# EAGLE design brd-gates-low (EAGLE 7.3.0)
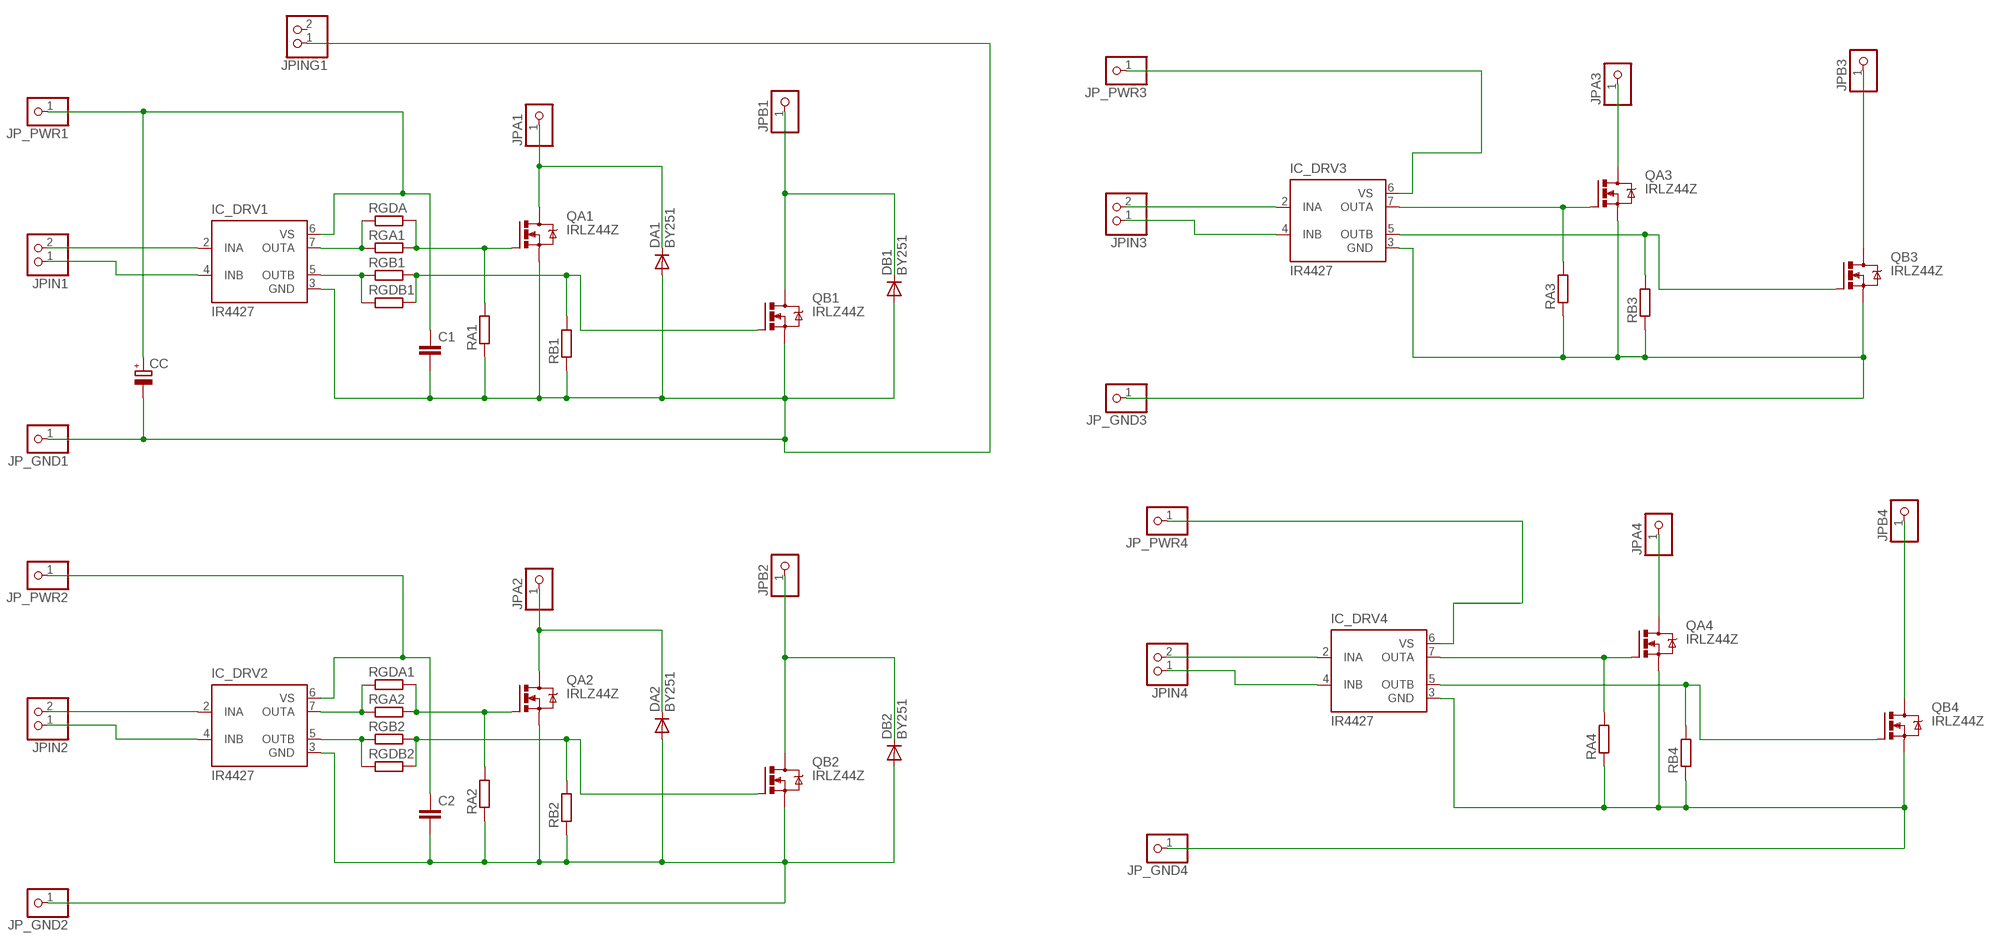
[diagram p0: schematic, sheet 1]

## Parts
C1  C-EU050-055X075  [C050-055X075]
C2  C-EU050-055X075  [C050-055X075]
CC  CPOL-EUE5-13  [E5-13]
DA1  BY251  [DO201-15]
DA2  BY251  [DO201-15]
DB1  BY251  [DO201-15]
DB2  BY251  [DO201-15]
IC_DRV1  IR4427  [DIL08]
IC_DRV2  IR4427  [DIL08]
IC_DRV3  IR4427  [DIL08]
IC_DRV4  IR4427  [DIL08]
JP_GND1  PINHD-1X1  [1X01]
JP_GND2  PINHD-1X1  [1X01]
JP_GND3  PINHD-1X1  [1X01]
JP_GND4  PINHD-1X1  [1X01]
JP_PWR1  PINHD-1X1  [1X01]
JP_PWR2  PINHD-1X1  [1X01]
JP_PWR3  PINHD-1X1  [1X01]
JP_PWR4  PINHD-1X1  [1X01]
JPA1  PINHD-1X1  [1X01]
JPA2  PINHD-1X1  [1X01]
JPA3  PINHD-1X1  [1X01]
JPA4  PINHD-1X1  [1X01]
JPB1  PINHD-1X1  [1X01]
JPB2  PINHD-1X1  [1X01]
JPB3  PINHD-1X1  [1X01]
JPB4  PINHD-1X1  [1X01]
JPIN1  PINHD-1X2  [1X02]
JPIN2  PINHD-1X2  [1X02]
JPIN3  PINHD-1X2  [1X02]
JPIN4  PINHD-1X2  [1X02]
JPING1  PINHD-1X2  [1X02]
QA1  IRLZ44Z  [TO220BH]
QA2  IRLZ44Z  [TO220BH]
QA3  IRLZ44Z  [TO220BH]
QA4  IRLZ44Z  [TO220BH]
QB1  IRLZ44Z  [TO220BH]
QB2  IRLZ44Z  [TO220BH]
QB3  IRLZ44Z  [TO220BH]
QB4  IRLZ44Z  [TO220BH]
RA1  R-EU_0207/10  [0207/10]
RA2  R-EU_0207/10  [0207/10]
RA3  R-EU_0207/10  [0207/10]
RA4  R-EU_0207/10  [0207/10]
RB1  R-EU_0207/10  [0207/10]
RB2  R-EU_0207/10  [0207/10]
RB3  R-EU_0207/10  [0207/10]
RB4  R-EU_0207/10  [0207/10]
RGA1  R-EU_0207/10  [0207/10]
RGA2  R-EU_0207/10  [0207/10]
RGB1  R-EU_0207/10  [0207/10]
RGB2  R-EU_0207/10  [0207/10]
RGDA  R-EU_0207/10  [0207/10]
RGDA1  R-EU_0207/10  [0207/10]
RGDB1  R-EU_0207/10  [0207/10]
RGDB2  R-EU_0207/10  [0207/10]

## Nets
GND: C1.2 CC.- DA1.A DB1.A IC_DRV1.3(GND) JP_GND1.1 JPING1.1 QA1.S QB1.S RA1.1 RB1.1
GND1: C2.2 DA2.A DB2.A IC_DRV2.3(GND) JP_GND2.1 QA2.S QB2.S RA2.1 RB2.1
GND2: IC_DRV3.3(GND) JP_GND3.1 QA3.S QB3.S RA3.1 RB3.1
GND3: IC_DRV4.3(GND) JP_GND4.1 QA4.S QB4.S RA4.1 RB4.1
N$1: IC_DRV1.2(INA) JPIN1.2
N$2: IC_DRV1.4(INB) JPIN1.1
N$3: IC_DRV1.7(OUTA) RGA1.1 RGDA.1
N$4: IC_DRV1.5(OUTB) RGB1.1 RGDB1.1
N$5: QA1.G RA1.2 RGA1.2 RGDA.2
N$6: QB1.G RB1.2 RGB1.2 RGDB1.2
N$7: IC_DRV2.7(OUTA) RGA2.1 RGDA1.1
N$8: IC_DRV2.5(OUTB) RGB2.1 RGDB2.1
N$9: QA2.G RA2.2 RGA2.2 RGDA1.2
N$10: QB2.G RB2.2 RGB2.2 RGDB2.2
N$11: DA2.C JPA2.1 QA2.D
N$12: DB2.C JPB2.1 QB2.D
N$13: IC_DRV2.4(INB) JPIN2.1
N$14: IC_DRV2.2(INA) JPIN2.2
N$16: IC_DRV3.7(OUTA) QA3.G RA3.2
N$17: IC_DRV3.5(OUTB) QB3.G RB3.2
N$18: IC_DRV4.7(OUTA) QA4.G RA4.2
N$19: IC_DRV4.5(OUTB) QB4.G RB4.2
N$20: JPA3.1 QA3.D
N$21: DB1.C JPB1.1 QB1.D
N$22: DA1.C JPA1.1 QA1.D
N$23: JPB3.1 QB3.D
N$24: IC_DRV3.4(INB) JPIN3.1
N$25: IC_DRV3.2(INA) JPIN3.2
N$26: JPA4.1 QA4.D
N$27: JPB4.1 QB4.D
N$28: IC_DRV4.4(INB) JPIN4.1
N$29: IC_DRV4.2(INA) JPIN4.2
VCC: C1.1 CC.+ IC_DRV1.6(VS) JP_PWR1.1
VCC1: C2.1 IC_DRV2.6(VS) JP_PWR2.1
VCC2: IC_DRV3.6(VS) JP_PWR3.1
VCC3: IC_DRV4.6(VS) JP_PWR4.1
Unconnected: JPING1.2

## Library data of the parts
C1 C2 = rcl:C-EU: CAPACITOR, European symbol
CC = rcl:CPOL-EU: POLARIZED CAPACITOR, European symbol
DA1 DA2 DB1 DB2 = diode:BY251: DIODE Si, 200 V, 3 A
IC_DRV1-IC_DRV4 = ir:IR4427: DUAL LOW SIDE DRIVER Source: ID4426.pdf; MF: INTERNATIONAL RECTIFIER(IR); MPN: IR4427; OC_FARNELL: 1023267; OC_NEWARK: 27C6914
JP_GND1-JP_GND4 JP_PWR1-JP_PWR4 JPA1-JPA4 JPB1-JPB4 = dbg-misc:PINHD-1X1: PIN HEADER
JPIN1-JPIN4 JPING1 = pinhead:PINHD-1X2: PIN HEADER
QA1-QA4 QB1-QB4 = dbg-misc:IRLZ44Z: N-Channel HEXFET® Power MOSFET Logic Level AUTOMOTIVE MOSFET Source: http://www.irf.com/product-info/datasheets/data/irlz44zpbf.pdf
RA1-RA4 RB1-RB4 RGA1 RGA2 RGB1 RGB2 RGDA RGDA1 RGDB1 RGDB2 = rcl:R-EU_: RESISTOR, European symbol

## Board
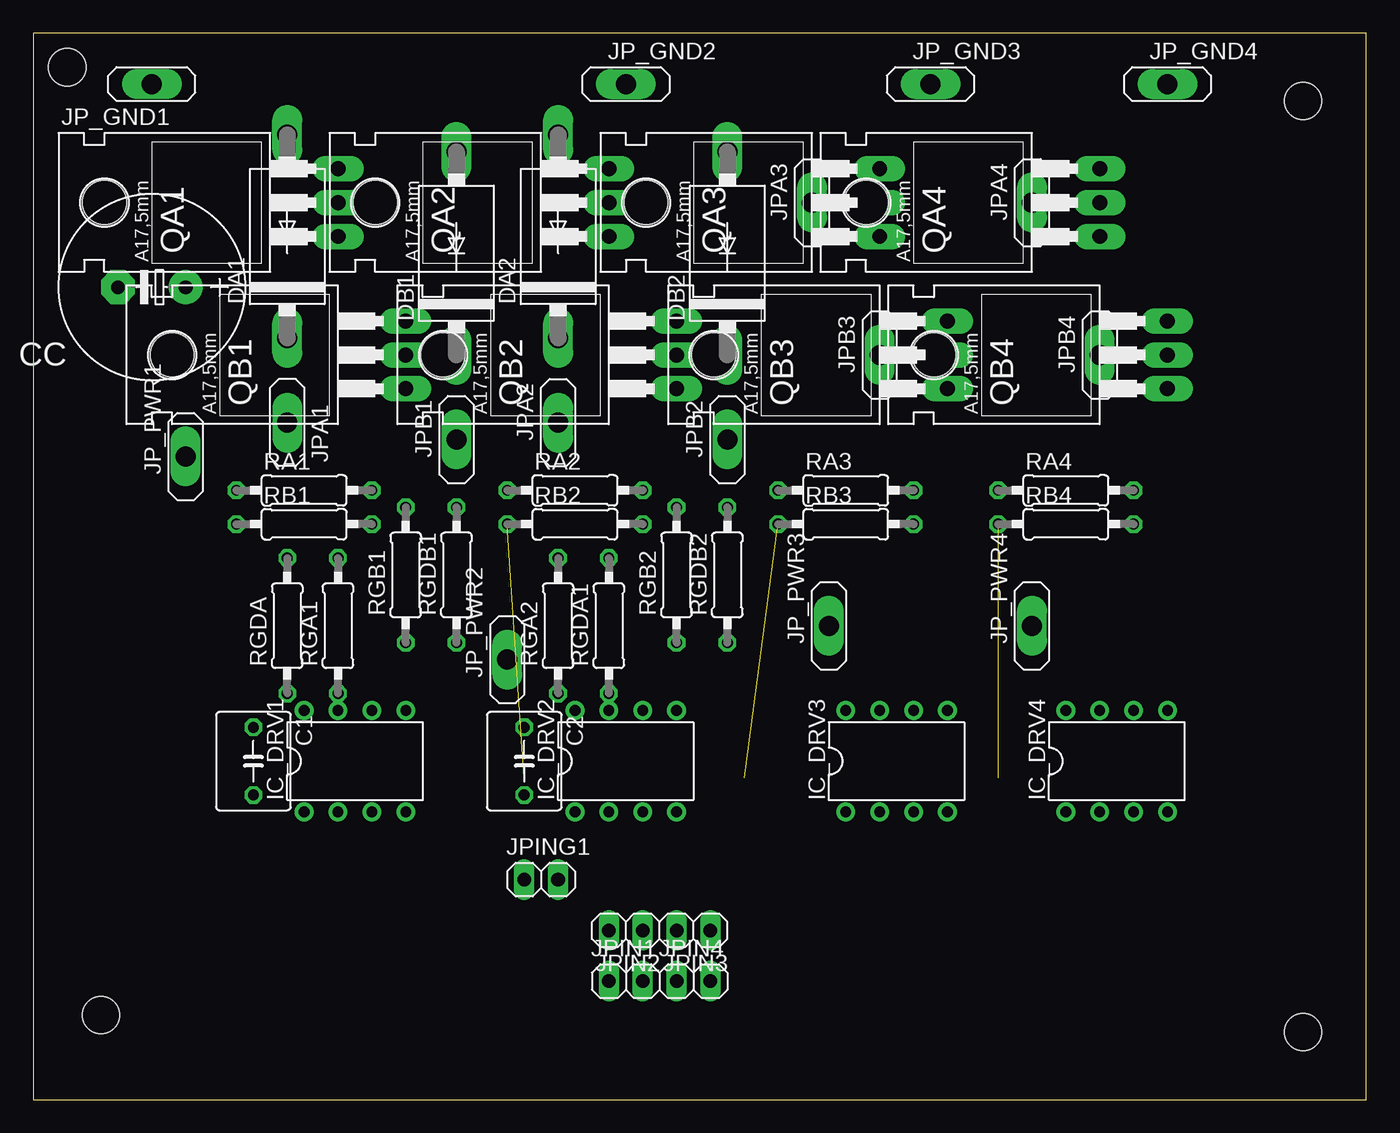
[diagram p1: board, top side]
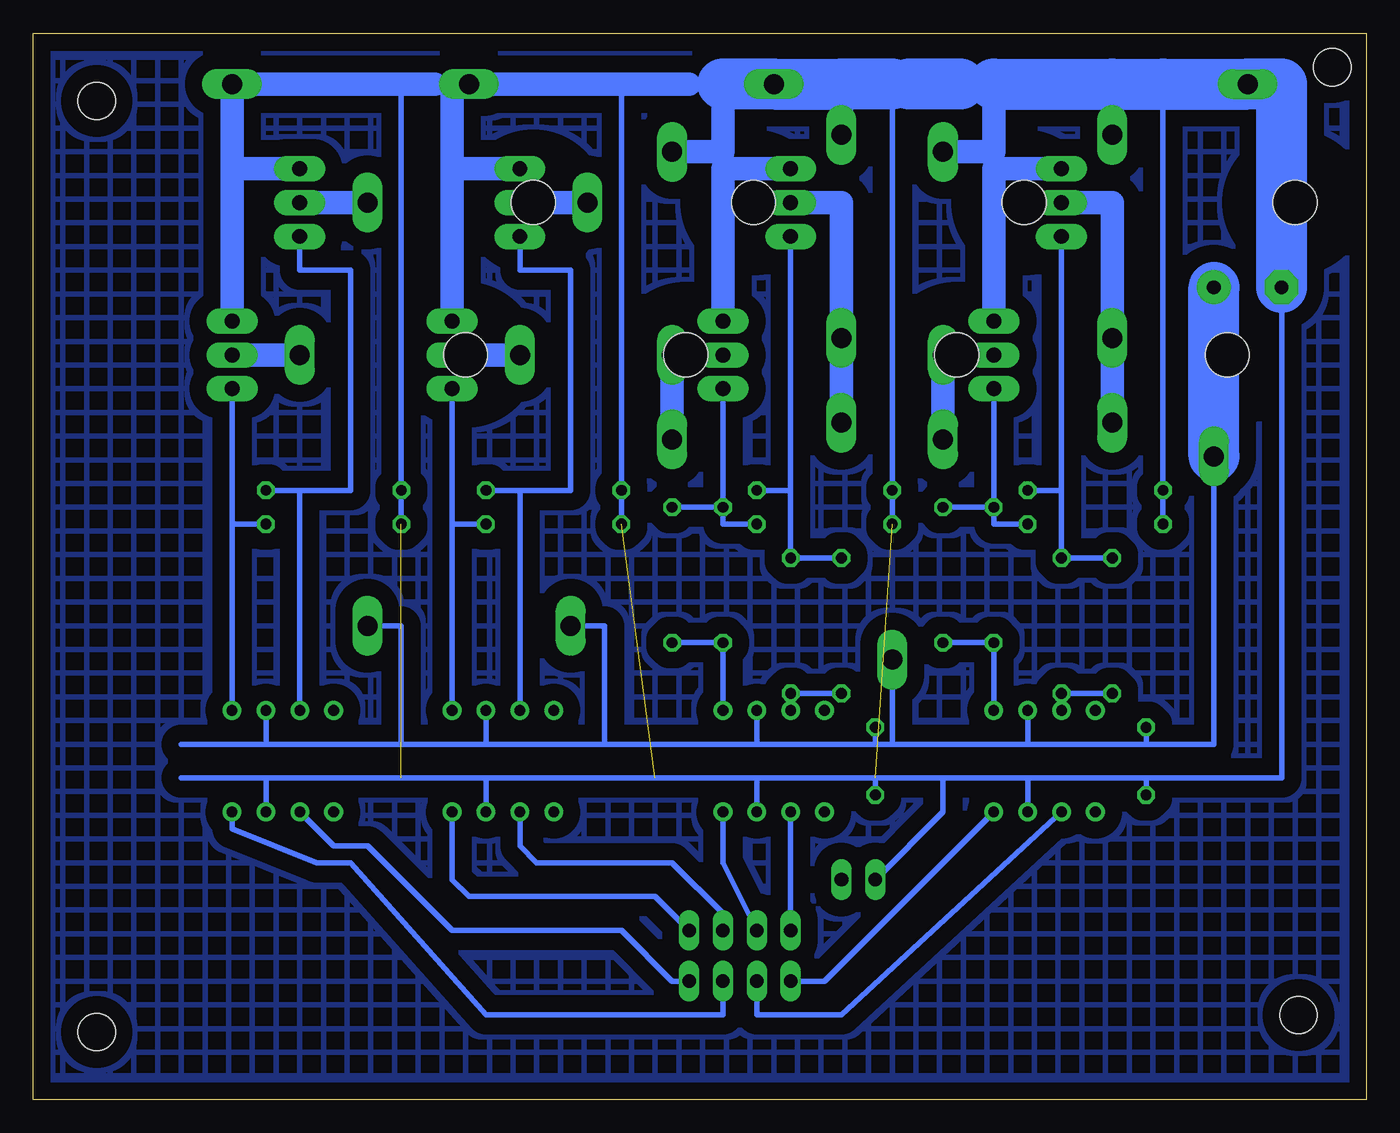
[diagram p2: board, bottom side, seen from below]

Size 100 x 80 mm. Coordinates in mm from the lower left corner, seen from the top.
Outline: 0,0 100,0 100,80 0,80 0,0
Copper layers (1*16): Top 0.035mm / dielectric 1.5mm / Bottom 0.035mm
Design rules "default": minimum track width 10mil, minimum drill 24mil, track to track 8mil, track to pad 8mil, pad to pad 8mil, via to via 8mil, smd to smd 8mil, copper to edge 40mil, drill to drill 8mil, minimum pad ring 10mil, minimum via ring 8mil, stop-mask expansion 4mil, vias tented up to drill 0mil, thermal gap 10mil
Holes 2.8 mm at 2.54,77.47 5.08,6.35 95.25,74.93 95.25,5.08

### Footprints (pad centres in the part's own frame; a part is rotated, then mirrored left to right if it is on the bottom)
C050-055X075 = drill 0.813 octagon: 1 -2.54,0; 2 2.54,0
E5-13 = drill 1.016 pad 2.54: + -2.54,0 | drill 1.016 pad 2.54 octagon: - 2.54,0
DO201-15 = drill 1.499 long: A 7.62,0; C -7.62,0
DIL08 = drill 0.8 pad 1.4: 1 -3.81,-3.81; 2 -1.27,-3.81; 3 1.27,-3.81; 4 3.81,-3.81; 5 3.81,3.81; 6 1.27,3.81; 7 -1.27,3.81; 8 -3.81,3.81
1X01 = drill 1.5 long: 1 0,0
1X02 = drill 1.016 long: 1 -1.27,0; 2 1.27,0
TO220BH = drill 1.118 pad 1.93 long: D 0,-6.35; G -2.54,-6.35; S 2.54,-6.35 | hole 3.302: 0,11.176
0207/10 = drill 0.813 octagon: 1 -5.08,0; 2 5.08,0

### Placement (x,y rotation side)
C1  16.51,25.4 270 top
C2  36.83,25.4 270 top
CC  8.89,60.96 180 top
DA1  19.05,64.77 90 top
DA2  39.37,64.77 90 top
DB1  31.75,63.5 90 top
DB2  52.07,63.5 90 top
IC_DRV1  24.13,25.4 0 top
IC_DRV2  44.45,25.4 0 top
IC_DRV3  64.77,25.4 0 top
IC_DRV4  81.28,25.4 0 top
JP_GND1  8.89,76.2 180 top
JP_GND2  44.45,76.2 0 top
JP_GND3  67.31,76.2 0 top
JP_GND4  85.09,76.2 0 top
JP_PWR1  11.43,48.26 90 top
JP_PWR2  35.56,33.02 90 top
JP_PWR3  59.69,35.56 90 top
JP_PWR4  74.93,35.56 90 top
JPA1  19.05,50.8 270 top
JPA2  39.37,50.8 90 top
JPA3  58.42,67.31 90 top
JPA4  74.93,67.31 90 top
JPB1  31.75,49.53 90 top
JPB2  52.07,49.53 90 top
JPB3  63.5,55.88 90 top
JPB4  80.01,55.88 90 top
JPIN1  44.45,8.89 0 top
JPIN2  44.45,12.7 180 top
JPIN3  49.53,12.7 180 top
JPIN4  49.53,8.89 0 top
JPING1  38.1,16.51 0 top
QA1  16.51,67.31 90 top
QA2  36.83,67.31 90 top
QA3  57.15,67.31 90 top
QA4  73.66,67.31 90 top
QB1  21.59,55.88 90 top
QB2  41.91,55.88 90 top
QB3  62.23,55.88 90 top
QB4  78.74,55.88 90 top
RA1  20.32,45.72 0 top
RA2  40.64,45.72 0 top
RA3  60.96,45.72 0 top
RA4  77.47,45.72 0 top
RB1  20.32,43.18 0 top
RB2  40.64,43.18 0 top
RB3  60.96,43.18 0 top
RB4  77.47,43.18 0 top
RGA1  22.86,35.56 90 top
RGA2  39.37,35.56 90 top
RGB1  27.94,39.37 90 top
RGB2  48.26,39.37 90 top
RGDA  19.05,35.56 90 top
RGDA1  43.18,35.56 90 top
RGDB1  31.75,39.37 90 top
RGDB2  52.07,39.37 90 top

### Tracks (layer width: path | path; a pad name or v marks a point on that pad's centre or on a via)
GND
  Bottom 0.406: IC_DRV1.3 25.4,24.13 | 25.4,24.13 16.51,24.13 | 16.51,24.13 6.35,24.13 CC.- | 25.4,24.13 31.75,24.13 | 31.75,24.13 44.45,24.13 | RB1.1 RA1.1 15.24,76.2 | C1.2 16.51,24.13 | JPING1.1 31.75,21.59 31.75,24.13
  Bottom 1.016: 27.94,69.85 27.94,71.12
  Bottom 1.778: QB1.S 27.94,69.85 QA1.S | 27.94,76.2 27.94,71.12 DB1.A | DA1.A 19.05,76.2
  Bottom 3.81: 27.94,76.2 19.05,76.2 15.24,76.2 JP_GND1.1 6.35,76.2 CC.-
GND1  (1 unrouted)
  Bottom 0.406: RB2.1 RA2.1 35.56,76.2 | 48.26,71.12 48.26,69.85 | IC_DRV2.3 45.72,24.13 | 45.72,24.13 59.69,24.13 | 45.72,24.13 36.83,24.13 | 30.48,24.13 36.83,24.13 | 36.83,24.13 C2.2
  Bottom 1.778: 48.26,76.2 48.26,71.12 DB2.A | QB2.S 48.26,69.85 QA2.S | DA2.A 39.37,76.2
  Bottom 3.81: 35.56,76.2 39.37,76.2 JP_GND2.1 48.26,76.2
GND2  (1 unrouted)
  Bottom 0.406: JP_GND3.1 68.58,76.2 | IC_DRV3.3 66.04,24.13 | 66.04,24.13 76.2,24.13 | 66.04,24.13 53.34,24.13 | RB3.1 RA3.1 55.88,76.2
  Bottom 1.778: 68.58,76.2 68.58,69.85 | 68.58,69.85 QB3.S | QA3.S 68.58,69.85 | JP_GND3.1 57.15,76.2 55.88,76.2 50.8,76.2
GND3  (1 unrouted)
  Bottom 0.406: IC_DRV4.3 82.55,24.13 | 82.55,24.13 72.39,24.13 | 82.55,24.13 88.9,24.13 | RB4.1 RA4.1 72.39,76.2
  Bottom 1.778: 85.09,69.85 JP_GND4.1 72.39,76.2 69.85,76.2 | 85.09,69.85 QB4.S | QA4.S 85.09,69.85
N$1
  Bottom 0.406: IC_DRV1.2 39.37,6.35 45.72,6.35 JPIN1.2
N$2
  Bottom 0.406: IC_DRV1.4 40.64,8.89 JPIN1.1
N$3
  Bottom 0.406: IC_DRV1.7 RGA1.1 RGDA.1
N$4
  Bottom 0.406: IC_DRV1.5 RGB1.1 RGDB1.1
N$5
  Bottom 0.406: RGDA.2 RGA1.2 22.86,45.72 | QA1.G 22.86,45.72 | RA1.2 22.86,45.72
N$6
  Bottom 0.406: RGB1.2 RGDB1.2 | QB1.G RGB1.2 | RGB1.2 27.94,43.18 RB1.2
N$7
  Bottom 0.406: IC_DRV2.7 RGDA1.1 RGA2.1
N$8
  Bottom 0.406: IC_DRV2.5 RGB2.1 RGDB2.1
N$9
  Bottom 0.406: RGA2.2 RGDA1.2 43.18,45.72 | QA2.G 43.18,45.72 | RA2.2 43.18,45.72
N$10
  Bottom 0.406: RGDB2.2 RGB2.2 | RB2.2 48.26,43.18 RGB2.2 | QB2.G RGB2.2
N$11
  Bottom 1.778: QA2.D 39.37,67.31 DA2.C JPA2.1
N$12
  Bottom 1.778: QB2.D DB2.C JPB2.1
N$13
  Bottom 0.406: IC_DRV2.4 48.26,17.78 JPIN2.1
N$14
  Bottom 0.406: IC_DRV2.2 JPIN2.2
N$15
  Bottom 0.406: 30.48,76.2 29.21,76.2
  Bottom 3.81: 30.48,76.2 34.29,76.2
N$16
  Bottom 0.406: IC_DRV3.7 63.5,45.72 | RA3.2 63.5,45.72 | QA3.G 63.5,62.23 59.69,62.23 59.69,45.72 63.5,45.72
N$17
  Bottom 0.406: IC_DRV3.5 68.58,43.18 | 68.58,43.18 QB3.G | RB3.2 68.58,43.18
N$18
  Bottom 0.406: QA4.G 80.01,62.23 76.2,62.23 76.2,45.72 80.01,45.72 | 80.01,45.72 IC_DRV4.7 | RA4.2 80.01,45.72
N$19
  Bottom 0.406: 85.09,43.18 IC_DRV4.5 | QB4.G 85.09,43.18 | 85.09,43.18 RB4.2
N$20
  Bottom 1.778: JPA3.1 QA3.D
N$21
  Bottom 1.778: QB1.D DB1.C JPB1.1
N$22
  Bottom 1.778: QA1.D 19.05,67.31 DA1.C JPA1.1
N$23
  Bottom 1.778: JPB3.1 QB3.D
N$24
  Bottom 0.406: IC_DRV3.4 68.58,16.51 67.31,15.24 53.34,15.24 JPIN3.1
N$25
  Bottom 0.406: IC_DRV3.2 63.5,19.05 62.23,17.78 52.07,17.78 48.26,13.97 JPIN3.2
N$26
  Bottom 1.778: QA4.D JPA4.1
N$27
  Bottom 1.778: QB4.D JPB4.1
N$28
  Bottom 0.406: JPIN4.1 48.26,6.35 66.04,6.35 76.2,17.78 78.74,17.78 85.09,20.32 IC_DRV4.4
N$29
  Bottom 0.406: JPIN4.2 52.07,8.89 55.88,12.7 68.58,12.7 74.93,19.05 77.47,19.05 IC_DRV4.2
N$30
  pour Bottom (isolate 1.27, hatched): 1.27,78.74 1.27,1.27 99.06,1.27 99.06,78.74
VCC
  Bottom 0.406: IC_DRV1.6 25.4,26.67 | 16.51,26.67 11.43,26.67 JP_PWR1.1 | 16.51,26.67 25.4,26.67 | 25.4,26.67 44.45,26.67 | C1.1 16.51,26.67
  Bottom 3.81: JP_PWR1.1 CC.+
VCC1
  Bottom 0.406: IC_DRV2.6 45.72,26.67 | 45.72,26.67 36.83,26.67 | C2.1 36.83,26.67 | 36.83,26.67 35.56,26.67 | 35.56,26.67 30.48,26.67 | 45.72,26.67 59.69,26.67 | JP_PWR2.1 35.56,26.67
VCC2
  Bottom 0.406: IC_DRV3.6 66.04,26.67 | 66.04,26.67 57.15,26.67 | 57.15,26.67 53.34,26.67 | 66.04,26.67 76.2,26.67 | JP_PWR3.1 57.15,35.56 57.15,26.67
VCC3
  Bottom 0.406: IC_DRV4.6 82.55,26.67 | 82.55,26.67 72.39,26.67 72.39,35.56 JP_PWR4.1 | 82.55,26.67 88.9,26.67